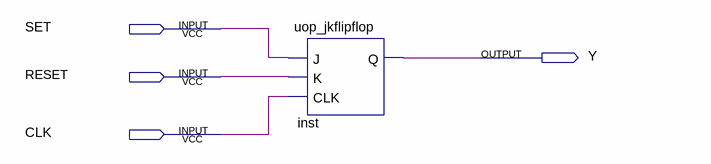
[diagram p0: schematic sheet]
// Quartus schematic behavioural.bdf as structural Verilog: 1 symbols, 4 pins
module behavioural (
  input  SET,
  input  RESET,
  input  CLK,
  output Y
);

  uop_jkflipflop inst (.J(SET), .K(RESET), .CLK(CLK), .Q(Y));
endmodule
